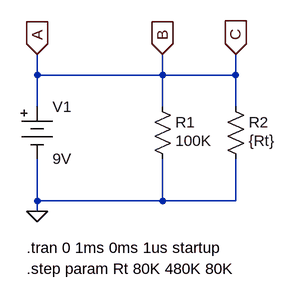
[diagram p0: schematic Parallel Resistor Network.asc]
Parallel Resistor Network.asc, the LTspice schematic file:
Version 4
SHEET 1 880 680
WIRE 96 112 96 80
WIRE 288 112 288 80
WIRE 288 112 96 112
WIRE 400 112 400 80
WIRE 400 112 288 112
WIRE 96 160 96 112
WIRE 288 160 288 112
WIRE 400 160 400 112
WIRE 96 304 96 240
WIRE 288 304 288 240
WIRE 288 304 96 304
WIRE 400 304 400 240
WIRE 400 304 288 304
WIRE 96 320 96 304
FLAG 96 80 A
IOPIN 96 80 In
FLAG 288 80 B
IOPIN 288 80 In
FLAG 400 80 C
IOPIN 400 80 In
FLAG 96 320 0
SYMBOL Misc\\battery 96 144 R0
WINDOW 123 0 0 Left 0
WINDOW 39 0 0 Left 0
SYMATTR InstName V1
SYMATTR Value 9V
SYMBOL res 272 144 R0
WINDOW 3 36 68 Left 2
SYMATTR Value 100K
SYMATTR InstName R1
SYMATTR SpiceLine tol=1 pwr=0.1
SYMBOL res 384 144 R0
WINDOW 3 36 68 Left 2
SYMATTR Value {Rt}
SYMATTR InstName R2
TEXT 80 376 Left 2 !.tran 0 1ms 0ms 1us startup
TEXT 80 408 Left 2 !.step param Rt 80K 480K 80K

The netlist it stands for:
* Parallel Resistor Network.asc
V1 C 0 9V
R1 C 0 100K tol=1 pwr=0.1
R2 C 0 {Rt}
.tran 0 1ms 0ms 1us startup
.step param Rt 80K 480K 80K
.backanno
.end